# EAGLE design schematic (EAGLE 9.0.0)
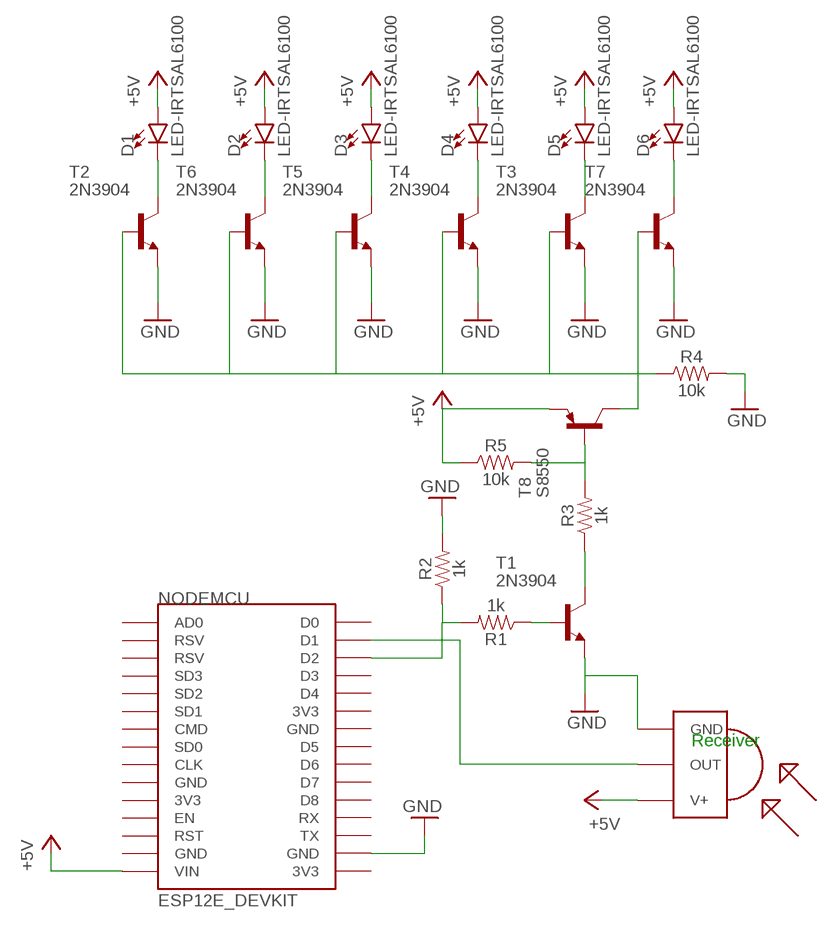
[diagram p0: schematic, sheet 1]

## Parts
D1  LED-IRTSAL6100  [LED_5MM]
D2  LED-IRTSAL6100  [LED_5MM]
D3  LED-IRTSAL6100  [LED_5MM]
D4  LED-IRTSAL6100  [LED_5MM]
D5  LED-IRTSAL6100  [LED_5MM]
D6  LED-IRTSAL6100  [LED_5MM]
NODEMCU  ESP12E_DEVKIT  [ESP12E_DEVKIT]
R1  1k  1KOHM-HORIZ-1/4W-1%  [AXIAL-0.3]
R2  1k  1KOHM-HORIZ-1/4W-1%  [AXIAL-0.3]
R3  1k  1KOHM-HORIZ-1/4W-1%  [AXIAL-0.3]
R4  10k  10KOHM-HORIZ-1/4W-1%  [AXIAL-0.3]
R5  10k  10KOHM-HORIZ-1/4W-1%  [AXIAL-0.3]
RECEIVER  TSOP4838  [TSOP18XX]
T1  2N3904  [TO92]
T2  2N3904  [TO92]
T3  2N3904  [TO92]
T4  2N3904  [TO92]
T5  2N3904  [TO92]
T6  2N3904  [TO92]
T7  2N3904  [TO92]
T8  S8550  -PNP-TO92-EBC  [TO92-EBC]

## Nets
+5V: D1.A D2.A D3.A D4.A D5.A D6.A NODEMCU.VIN R5.P$1 RECEIVER.VCC(V+) T8.E
GND: NODEMCU.GND@3(GND) R2.P$2 R4.P$2 RECEIVER.GND T1.3(E) T2.3(E) T3.3(E) T4.3(E) T5.3(E) T6.3(E) T7.3(E)
N$1: NODEMCU.D2 R1.P$2 R2.P$1
N$2: R4.P$1 T2.2(B) T3.2(B) T4.2(B) T5.2(B) T6.2(B) T7.2(B) T8.C
N$3: R1.P$1 T1.2(B)
N$4: R3.P$1 T1.1(C)
N$5: R3.P$2 R5.P$2 T8.B
N$6: NODEMCU.D1 RECEIVER.OUT
N$8: D6.K(C) T7.1(C)
N$10: D1.K(C) T2.1(C)
N$11: D2.K(C) T6.1(C)
N$12: D3.K(C) T5.1(C)
N$13: D4.K(C) T4.1(C)
N$14: D5.K(C) T3.1(C)
Unconnected: NODEMCU.3V3@0(3V3) NODEMCU.3V3@1(3V3) NODEMCU.3V3@2(3V3) NODEMCU.AD0 NODEMCU.CLK NODEMCU.CMD NODEMCU.D0 NODEMCU.D3 NODEMCU.D4 NODEMCU.D5 NODEMCU.D6 NODEMCU.D7 NODEMCU.D8 NODEMCU.EN NODEMCU.GND@0(GND) NODEMCU.GND@1(GND) NODEMCU.GND@2(GND) NODEMCU.RST NODEMCU.RSV@0(RSV) NODEMCU.RSV@1(RSV) NODEMCU.RX NODEMCU.SD0 NODEMCU.SD1 NODEMCU.SD2 NODEMCU.SD3 NODEMCU.TX

## Notes on the sheet
- Receiver

## Library data of the parts
D1-D6 = SparkFun-LED:LED-IR: Infrared LED (IR) Wavelength: 940nm Packages: TSAL6100 LTE302 - Side firing. Check SparkFun-Sensors.lbr for the receiver SparkFun Products: ZX Distance and Gesture Sensor <[https://www.sparkfun.com/products/12780]> Infrared Emitters and Detectors <https://www.sparkfun.com/products/241>; OC_NEWARK: unknown; PROD_ID: DIO-12058
NODEMCU = ESP12E_DEVKIT:ESP12E_DEVKIT: ESP12E DEVKIT BOARD; OC_NEWARK: unknown
R1-R3 = SparkFun-Resistors:1KOHM: 1kΩ resistor A resistor is a passive two-terminal electrical component that implements electrical resistance as a circuit element. Resistors act to reduce current flow, and, at the same time, act to lower voltage levels within circuits. - Wikipedia; MF: FARNELL; MPN: MCF 0.25W 1K; OC_NEWARK: 38K0327; PROD_ID: RES-12182
R4 R5 = SparkFun-Resistors:10KOHM: 10kΩ resistor A resistor is a passive two-terminal electrical component that implements electrical resistance as a circuit element. Resistors act to reduce current flow, and, at the same time, act to lower voltage levels within circuits. - Wikipedia; MF: FARNELL; MPN: MCF 0.25W 10K; OC_NEWARK: 38K0328; PROD_ID: RES-12183
RECEIVER = tsop:TSOP4838: IR Receiver and Demodulator; MF: VISHAY/TELEFUNKEN; MPN: TSOP4838; OC_NEWARK: 60K6999
T1-T7 = transistor:2N3904: NPN TRANSISTOR; MF: FAIRCHILD SEMICONDUCTOR; MPN: 2N3904BU; OC_NEWARK: 83C3116
T8 = transistor-neu-to92:*-PNP-: PNP Transistror

## Net classes
0 default: width 0.508 mm

## Board
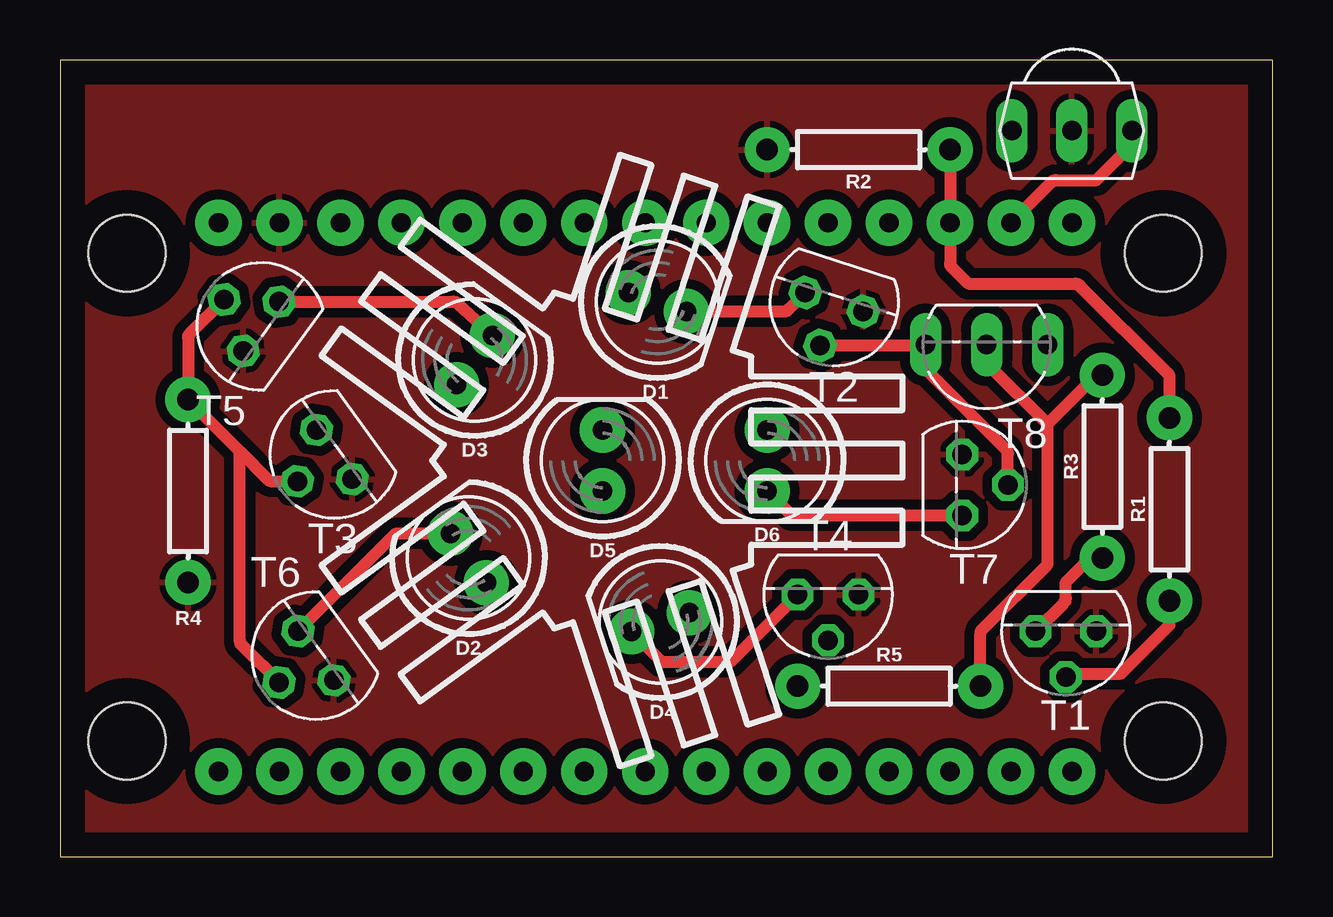
[diagram p1: board, top side]
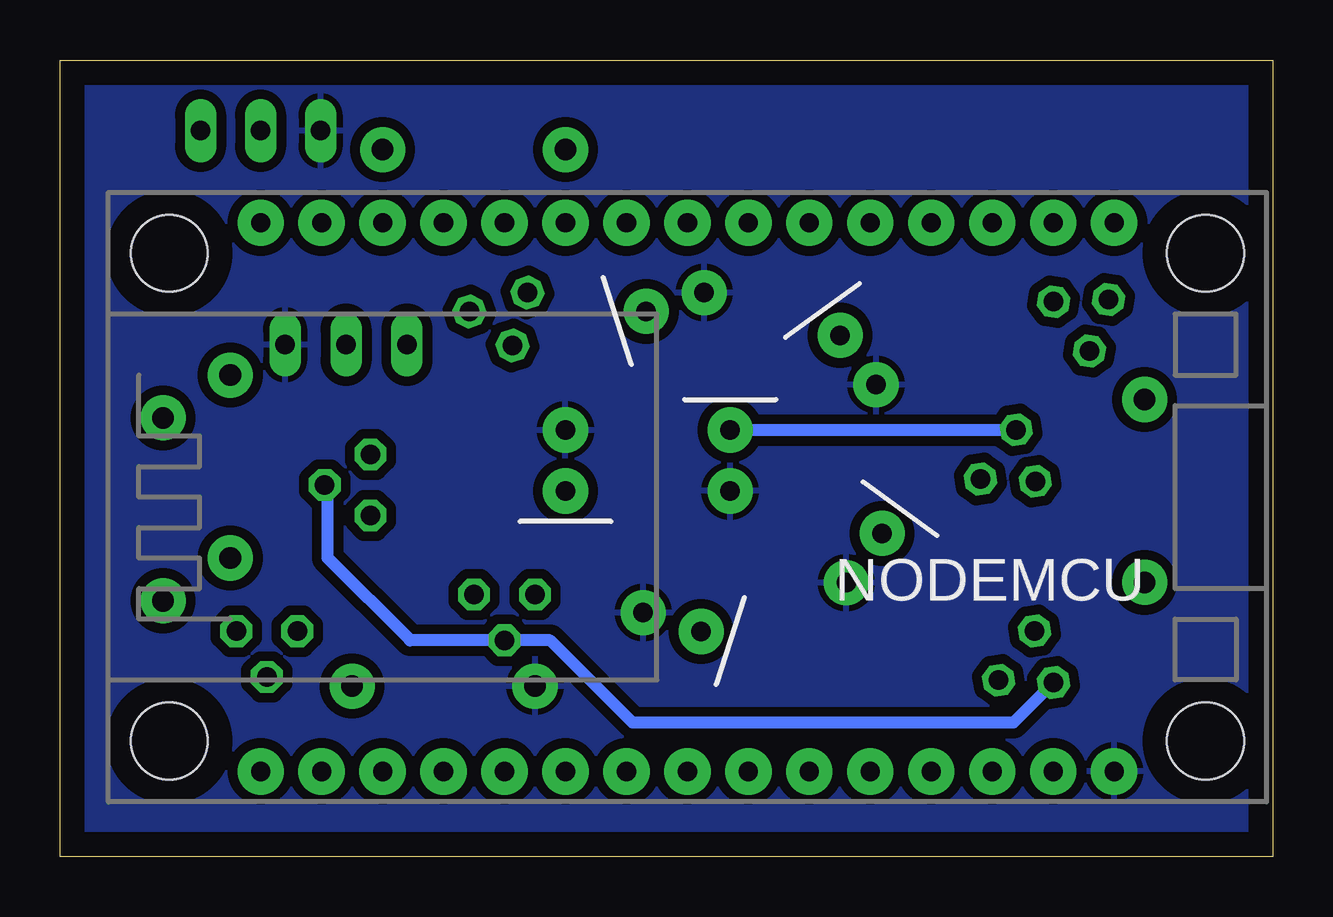
[diagram p2: board, bottom side, seen from below]

Size 50.53 x 33.2 mm. Coordinates in mm from the lower left corner, seen from the top.
Outline: 0,0 50.53,0 50.53,33.2 0,33.2 0,0
Copper layers (1*16): Top 0.035mm / dielectric 1.5mm / Bottom 0.035mm
Design rules "default *": minimum track width 6mil, minimum drill 0.15mm, track to track 6mil, track to pad 6mil, pad to pad 6mil, via to via 6mil, smd to smd 6mil, copper to edge 40mil, drill to drill 6mil, minimum pad ring 10mil, minimum via ring 8mil, stop-mask expansion 4mil, vias tented up to drill 0mil, thermal gap 10mil

### Footprints (pad centres in the part's own frame; a part is rotated, then mirrored left to right if it is on the bottom)
LED_5MM = drill 0.813 pad 1.88: A -1.27,0; K 1.27,0
ESP12E_DEVKIT = drill 0.8 pad 1.93: 3V3@0 -11.43,-7.62; 3V3@1 11.43,5.08; 3V3@2 11.43,-17.78; AD0 -11.43,17.78; CLK -11.43,-2.54; CMD -11.43,2.54; D0 11.43,17.78; D1 11.43,15.24; D2 11.43,12.7; D3 11.43,10.16; D4 11.43,7.62; D5 11.43,0; D6 11.43,-2.54; D7 11.43,-5.08; D8 11.43,-7.62; EN -11.43,-10.16; GND@0 -11.43,-5.08; GND@1 -11.43,-15.24; GND@2 11.43,2.54; GND@3 11.43,-15.24; RST -11.43,-12.7; RSV@0 -11.43,15.24; RSV@1 -11.43,12.7; RX 11.43,-10.16; SD0 -11.43,0; SD1 -11.43,5.08; SD2 -11.43,7.62; SD3 -11.43,10.16; TX 11.43,-12.7; VIN -11.43,-17.78 | hole 3.2: -10.16,21.59; 10.16,21.59; 10.16,-21.59; -10.16,-21.59
AXIAL-0.3 = drill 0.9 pad 1.88: P$1 -3.81,0; P$2 3.81,0
TSOP18XX = drill 0.813 long: GND -0.001,-0.027; OUT -2.501,-0.027; VCC 2.499,-0.027
TO92 = drill 0.813 octagon: 1 1.27,0; 2 0,1.905; 3 -1.27,0
TO92-EBC = drill 0.813 long: B 0,-1.27; C 2.54,-1.27; E -2.54,-1.27

### Placement (x,y rotation side)
D1  24.89,23.11 342 top
D2  17.02,12.45 126 top
D3  17.27,20.7 54 top
D4  25.02,9.78 198 top
D5  22.61,16.51 90 top
D6  29.46,16.51 270 top
NODEMCU  24.38,14.99 90 bottom
R1  46.23,14.48 90 top
R2  33.27,29.46 180 top
R3  43.43,16.26 90 top
R4  5.33,15.24 270 top
R5  34.54,7.11 0 top
RECEIVER  42.16,30.23 180 top
T1  41.91,9.4 180 top
T2  32.26,23.11 162 top
T3  11.43,16.76 126 top
T4  32,10.92 180 top
T5  8.38,22.1 54 top
T6  10.67,8.38 126 top
T7  37.59,15.49 270 top
T8  38.61,20.07 180 top

### Tracks (layer width: path | path; a pad name or v marks a point on that pad's centre or on a via)
+5V
  pour Bottom (isolate 0.406): -3.05,35.05 -5.84,-1.52 50.8,-2.54 54.1,33.78
GND
  pour Top (isolate 0.406): -7.37,-7.37 57.15,-6.86 57.4,37.34 -7.37,36.58
N$1
  Top 0.508: R1.P$2 46.23,19.96 arc45 46.15,20.14 42.49,23.8 arc45 42.31,23.88 37.85,23.88 37.16,24.56 arc-45 37.08,24.74 NODEMCU.D2 R2.P$1
N$2
  Top 0.508: T5.2 5.41,21.79 arc45 5.33,21.61 R4.P$1 7.49,16.89 | 7.49,16.89 8.67,15.72 arc45 8.85,15.64 T3.2 | T6.2 7.57,8.82 arc-45 7.49,9 7.49,16.89 | T2.2 35.99,21.3 | 35.99,21.3 arc45 T8.C | T7.2 39.5,16.79 arc45 39.42,16.96 36.06,20.33 arc-45 35.99,20.51 35.99,21.3
  Bottom 0.508: T7.2 39.37,15.37 39.37,12.45 35.94,9.02 T4.2 30.1,9.02 26.67,5.59 10.8,5.59 T6.2
N$3
  Top 0.508: T1.2 41.96,7.55 arc-45 42.14,7.62 44.09,7.62 arc45 44.27,7.69 46.23,9.65 R1.P$1
N$4
  Top 0.508: T1.1 41.84,10.59 arc45 41.91,10.77 41.91,11.43 42.85,12.37 arc-45 43.03,12.45 R3.P$1
N$5
  Top 0.508: T8.B 38.61,20.68 arc45 38.68,20.5 41.15,18.03 | 41.15,18.03 43.11,19.99 arc-45 43.28,20.07 R3.P$2 | R5.P$2 38.35,9.29 arc-45 38.43,9.47 41.15,12.19 41.15,18.03
N$6
  Top 0.508: NODEMCU.D1 41.33,28.12 arc-45 41.51,28.19 43.18,28.19 44.59,29.61 arc45 44.67,29.78 RECEIVER.OUT
N$8
  Top 0.508: D6.K 30.41,14.3 arc45 30.59,14.22 T7.1
N$10
  Top 0.508: D1.K 30.16,22.72 arc45 30.34,22.8 T2.1
N$11
  Top 0.508: T6.1 13.91,13.4 arc-45 14.09,13.47 D2.K
N$12
  Top 0.508: T5.1 16.39,23.12 arc-45 16.57,23.05 D3.K
N$13
  Top 0.508: T4.1 27.94,8.13 25.07,8.13 D4.K
N$14
  Bottom 0.508: T3.1 D5.K